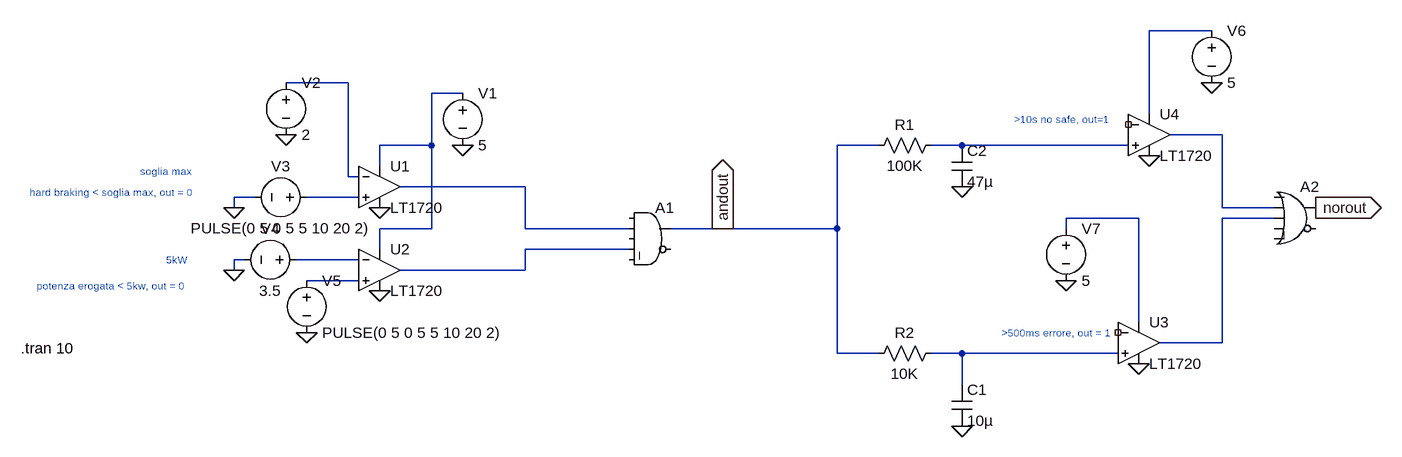
[diagram p0: schematic Draft2.asc]
Draft2.asc, the LTspice schematic file:
Version 4
SHEET 1 1640 680
WIRE 1344 -160 1248 -160
WIRE 16 -80 -80 -80
WIRE 192 -64 144 -64
WIRE 1248 -32 1248 -160
WIRE 1360 0 1280 0
WIRE 144 16 144 -64
WIRE 144 16 64 16
WIRE 832 16 768 16
WIRE 960 16 912 16
WIRE 1216 16 960 16
WIRE 64 48 64 16
WIRE 16 64 16 -80
WIRE 32 64 16 64
WIRE 288 80 96 80
WIRE -128 96 -160 96
WIRE 32 96 -48 96
WIRE -160 112 -160 96
WIRE 1360 112 1360 0
WIRE 1440 112 1360 112
WIRE 1232 128 1120 128
WIRE 1440 128 1360 128
WIRE 144 144 144 16
WIRE 144 144 64 144
WIRE 288 144 288 80
WIRE 448 144 288 144
WIRE 592 144 512 144
WIRE 768 144 768 16
WIRE 768 144 592 144
WIRE 1120 144 1120 128
WIRE 64 176 64 144
WIRE 448 176 288 176
WIRE -144 192 -160 192
WIRE 32 192 -64 192
WIRE -160 208 -160 192
WIRE 288 208 288 176
WIRE 288 208 96 208
WIRE 32 224 -48 224
WIRE 1232 288 1232 128
WIRE 1360 320 1360 128
WIRE 1360 320 1264 320
WIRE 768 336 768 144
WIRE 832 336 768 336
WIRE 960 336 912 336
WIRE 1200 336 960 336
WIRE 960 384 960 336
FLAG 64 112 0
FLAG 64 240 0
FLAG 192 16 0
FLAG -160 112 0
FLAG -160 208 0
FLAG -80 0 0
FLAG -48 304 0
FLAG 592 144 andout
IOPIN 592 144 Out
FLAG 960 448 0
FLAG 1232 352 0
FLAG 960 80 0
FLAG 1248 32 0
FLAG 1120 224 0
FLAG 1344 -80 0
FLAG 1504 112 norout
IOPIN 1504 112 Out
SYMBOL voltage 192 -80 R0
WINDOW 123 0 0 Left 0
WINDOW 39 0 0 Left 0
SYMATTR InstName V1
SYMATTR Value 5
SYMBOL Comparators\\LT1720 64 16 R0
SYMATTR InstName U1
SYMBOL Comparators\\LT1720 64 144 R0
SYMATTR InstName U2
SYMBOL voltage -80 -96 R0
WINDOW 123 0 0 Left 0
WINDOW 39 0 0 Left 0
SYMATTR InstName V2
SYMATTR Value 2
SYMBOL voltage -32 96 R90
WINDOW 0 -32 56 VBottom 2
WINDOW 3 32 56 VTop 2
WINDOW 123 0 0 Left 0
WINDOW 39 0 0 Left 0
SYMATTR InstName V3
SYMATTR Value PULSE(0 5 0 5 5 10 20 2)
SYMBOL voltage -48 192 R90
WINDOW 0 -32 56 VBottom 2
WINDOW 3 32 56 VTop 2
WINDOW 123 0 0 Left 0
WINDOW 39 0 0 Left 0
SYMATTR InstName V4
SYMATTR Value 3.5
SYMBOL voltage -48 208 R0
WINDOW 123 0 0 Left 0
WINDOW 39 0 0 Left 0
SYMATTR InstName V5
SYMATTR Value PULSE(0 5 0 5 5 10 20 2)
SYMBOL Digital\\and 480 96 R0
SYMATTR InstName A1
SYMBOL Digital\\or 1472 64 R0
SYMATTR InstName A2
SYMBOL res 928 320 R90
WINDOW 0 0 56 VBottom 2
WINDOW 3 32 56 VTop 2
SYMATTR InstName R2
SYMATTR Value 10K
SYMATTR SpiceLine tol=1 pwr=0.1
SYMBOL Comparators\\LT1720 1232 256 R0
SYMATTR InstName U3
SYMBOL Comparators\\LT1720 1248 -64 R0
SYMATTR InstName U4
SYMBOL voltage 1344 -176 R0
WINDOW 123 0 0 Left 0
WINDOW 39 0 0 Left 0
SYMATTR InstName V6
SYMATTR Value 5
SYMBOL voltage 1120 128 R0
WINDOW 123 0 0 Left 0
WINDOW 39 0 0 Left 0
SYMATTR InstName V7
SYMATTR Value 5
SYMBOL cap 944 384 R0
SYMATTR InstName C1
SYMATTR Value 10µ
SYMATTR SpiceLine V=6.3 Irms=0 Rser=0.003 Lser=828p
SYMBOL res 928 0 R90
WINDOW 0 0 56 VBottom 2
WINDOW 3 32 56 VTop 2
SYMATTR InstName R1
SYMATTR Value 100K
SYMATTR SpiceLine tol=1 pwr=0.1
SYMBOL cap 944 16 R0
SYMATTR InstName C2
SYMATTR Value 47µ
SYMATTR SpiceLine V=6.3 Irms=0 Rser=0.003 Lser=828p mfg="Würth Elektronik" pn="885012108004 WCAP-CSGP 1206" type="X5R"
TEXT -352 88 Center 1 ;hard braking < soglia max, out = 0
TEXT -352 232 Center 1 ;potenza erogata < 5kw, out = 0
TEXT -304 56 Left 1 ;soglia max
TEXT -264 192 Left 1 ;5kW
TEXT -488 328 Left 2 !.tran 10
TEXT 1104 304 Center 1 ;>500ms errore, out = 1
TEXT 1112 -24 Center 1 ;>10s no safe, out=1

The netlist it stands for:
* Draft2.asc
V1 N003 0 5
XU1 N007 N002 N003 0 N006 LT1720  ; pins In+ In- V+ V- OUT
XU2 N012 N011 N003 0 N010 LT1720  ; pins In+ In- V+ V- OUT
V2 N002 0 2
V3 N007 0 PULSE(0 5 0 5 5 10 20 2)
V4 N011 0 3.5
V5 N012 0 PULSE(0 5 0 5 5 10 20 2)
A1 0 N006 0 N010 0 0 andout 0 AND
A2 0 N004 N009 0 0 0 norout 0 OR
R2 N013 andout 10K tol=1 pwr=0.1
XU3 N013 NC_01 N008 0 N009 LT1720  ; pins In+ In- V+ V- OUT
XU4 N005 NC_02 N001 0 N004 LT1720  ; pins In+ In- V+ V- OUT
V6 N001 0 5
V7 N008 0 5
C1 N013 0 10µ V=6.3 Irms=0 Rser=0.003 Lser=828p
R1 N005 andout 100K tol=1 pwr=0.1
C2 N005 0 47µ V=6.3 Irms=0 Rser=0.003 Lser=828p mfg="Würth Elektronik" pn="885012108004 WCAP-CSGP 1206" type="X5R"
* hard braking < soglia max, out = 0
* potenza erogata < 5kw, out = 0
* soglia max
* 5kW
.tran 10
* >500ms errore, out = 1
* >10s no safe, out=1
.lib LT1720.sub
.backanno
.end